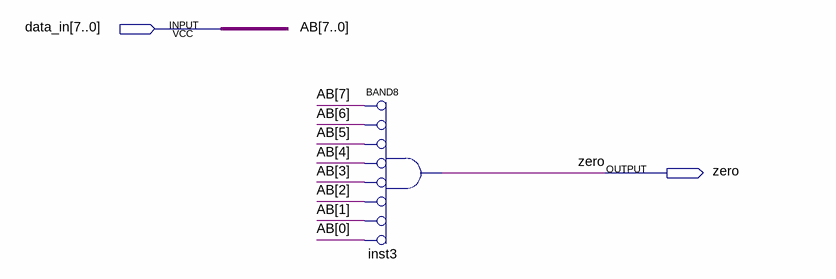
[diagram p0: schematic sheet]
// Quartus schematic zero_checker_8b.bdf as structural Verilog: 1 symbols, 2 pins
module zero_checker_8b (
  input  [7:0] data_in,
  output zero
);

  and inst3 (zero, ~data_in[7], ~data_in[6], ~data_in[5], ~data_in[4], ~data_in[3], ~data_in[2], ~data_in[1], ~data_in[0]);  // BAND8

  // Other names for the same wires on the sheet: AB[7:0] = data_in
endmodule
